# EAGLE schematic BlackIce (EAGLE 6.6.0)
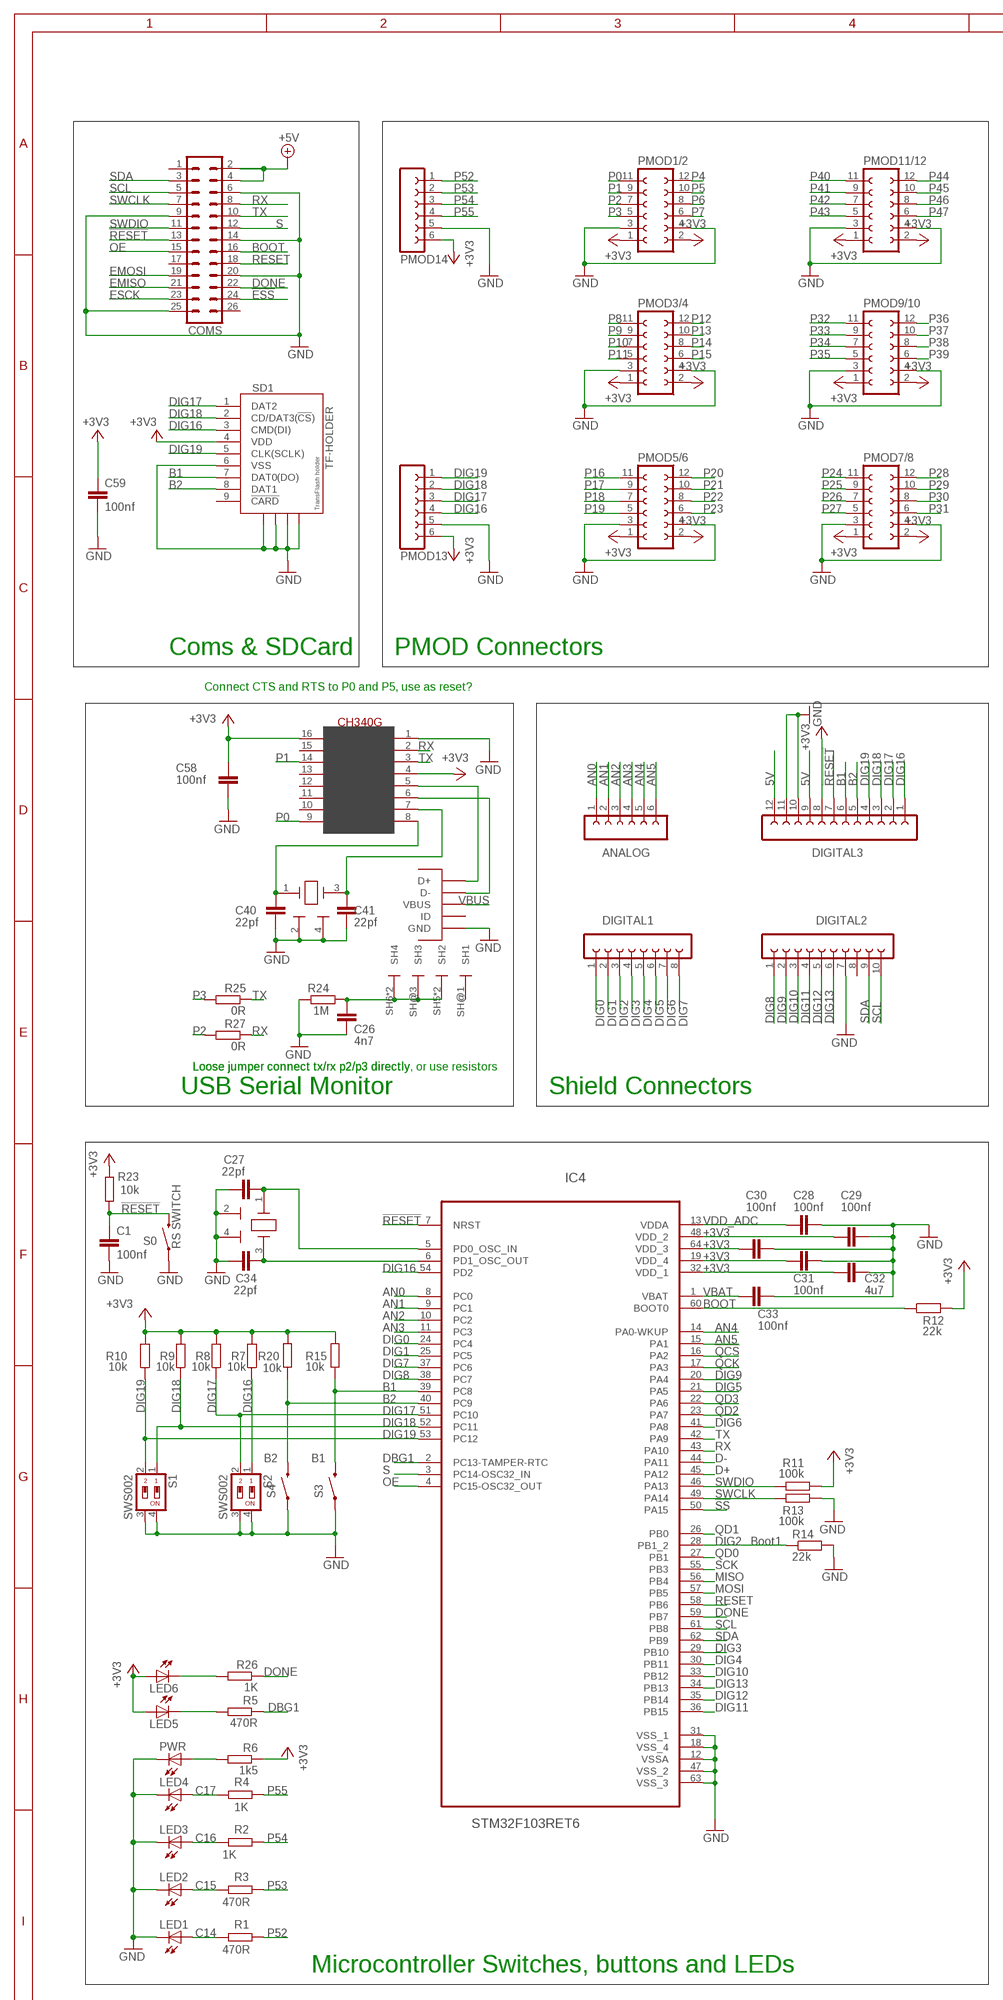
[diagram p0: schematic, sheet 1, part 1 of 2]
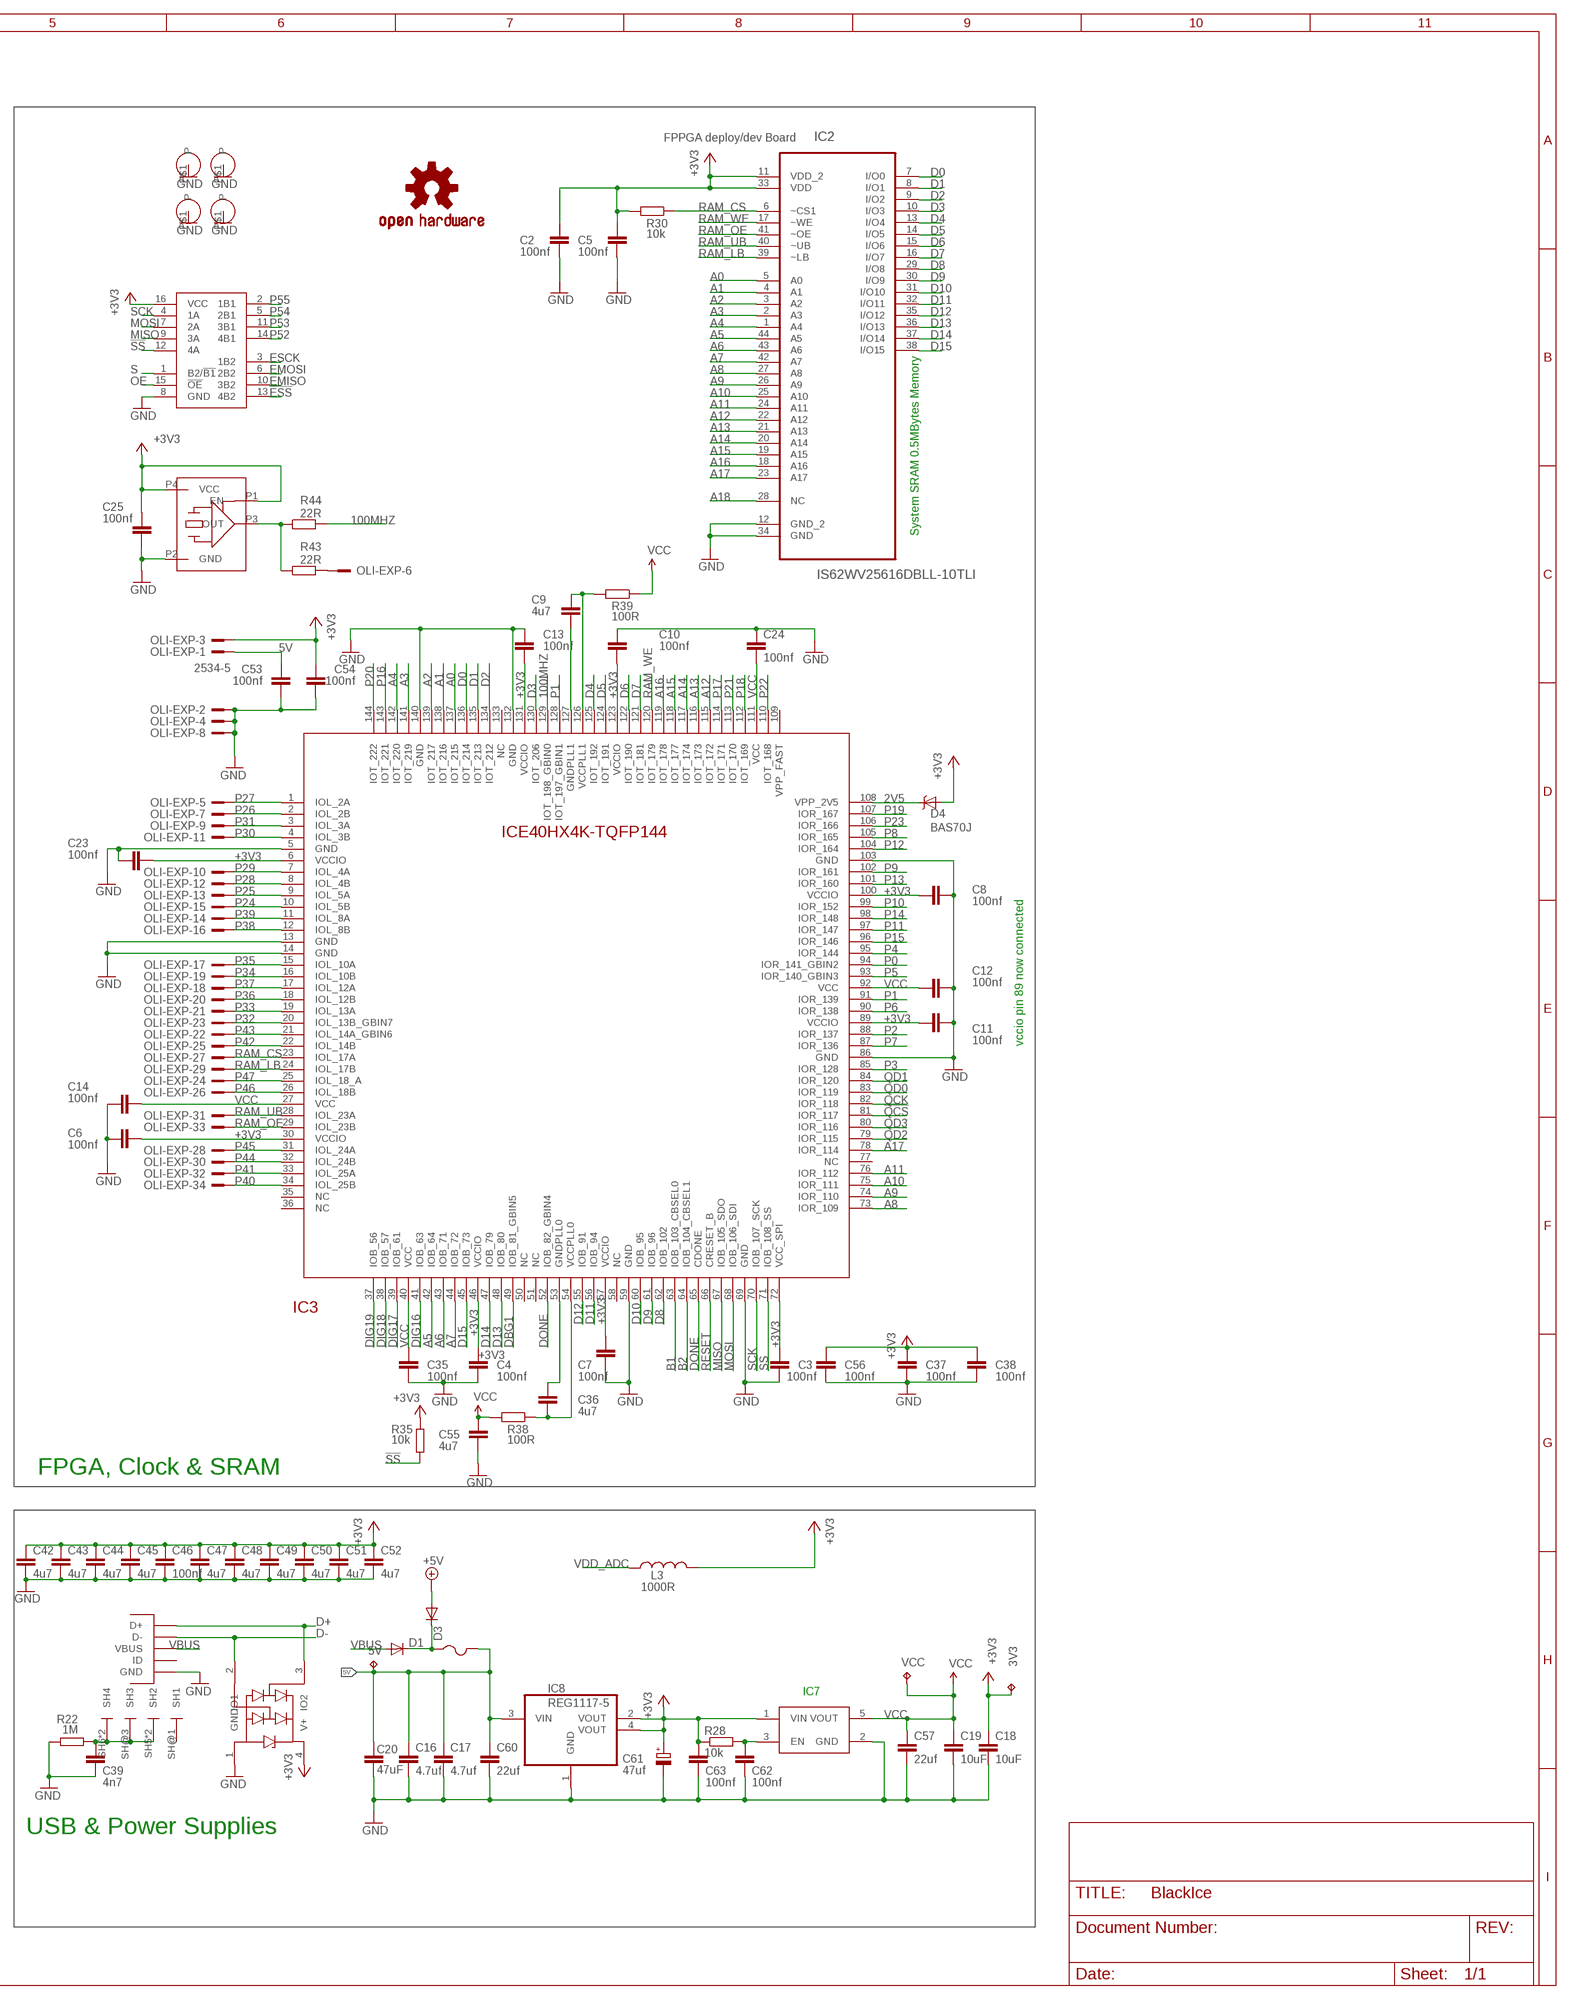
[diagram p1: schematic, sheet 1, part 2 of 2]

## Parts
3V3  TPB1,27  [B1,27]
5V  TPB1,27  [B1,27]
ANALOG  FE06-1  [FE06]
C1  100nf  C-EUC0402  [C0402]
C2  100nf  C-EUC0402  [C0402]
C3  100nf  C-EUC0402  [C0402]
C4  100nf  C-EUC0402  [C0402]
C5  100nf  C-EUC0402  [C0402]
C6  100nf  C-EUC0402  [C0402]
C7  100nf  C-EUC0402  [C0402]
C8  100nf  C-EUC0402  [C0402]
C9  4u7  C-EUC0402  [C0402]
C10  100nf  C-EUC0402  [C0402]
C11  100nf  C-EUC0402  [C0402]
C12  100nf  C-EUC0402  [C0402]
C13  100nf  C-EUC0402  [C0402]
C14  100nf  C-EUC0402  [C0402]
C16  4.7uf  C-EUC0402  [C0402]
C17  4.7uf  C-EUC0402  [C0402]
C18  10uF  C-EUC0603  [C0603]
C19  10uF  C-EUC0603  [C0603]
C20  47uF  C_1206  [1206]
C23  100nf  C-EUC0402  [C0402]
C24  100nf  C-EUC0402  [C0402]
C25  100nf  C-EUC0402  [C0402]
C26  4n7  C-EUC0402  [C0402]
C27  22pf  C-EUC0402  [C0402]
C28  100nf  C-EUC0402  [C0402]
C29  100nf  C-EUC0402  [C0402]
C30  100nf  C-EUC0402  [C0402]
C31  100nf  C-EUC0402  [C0402]
C32  4u7  C-EUC0402  [C0402]
C33  100nf  C-EUC0402  [C0402]
C34  22pf  C-EUC0402  [C0402]
C35  100nf  C-EUC0402  [C0402]
C36  4u7  C-EUC0402  [C0402]
C37  100nf  C-EUC0402  [C0402]
C38  100nf  C-EUC0402  [C0402]
C39  4n7  C-EUC0402  [C0402]
C40  22pf  C-EUC0402  [C0402]
C41  22pf  C-EUC0402  [C0402]
C42  4u7  C-EUC0402  [C0402]
C43  4u7  C-EUC0402  [C0402]
C44  4u7  C-EUC0402  [C0402]
C45  4u7  C-EUC0402  [C0402]
C46  100nf  C-EUC0402  [C0402]
C47  4u7  C-EUC0402  [C0402]
C48  4u7  C-EUC0402  [C0402]
C49  4u7  C-EUC0402  [C0402]
C50  4u7  C-EUC0402  [C0402]
C51  4u7  C-EUC0402  [C0402]
C52  4u7  C-EUC0402  [C0402]
C53  100nf  C-EUC0402  [C0402]
C54  100nf  C-EUC0402  [C0402]
C55  4u7  C-EUC0402  [C0402]
C56  100nf  C-EUC0402  [C0402]
C57  22uf  C-EUC0603  [C0603]
C58  100nf  C-EUC0402  [C0402]
C59  100nf  C-EUC0402  [C0402]
C60  22uf  C-EUC0603  [C0603]
C61  47uf  CPOL-EUR/2012-12W  [R/2012-12W]
C62  100nf  C-EUC0402  [C0402]
C63  100nf  C-EUC0402  [C0402]
COM  FCI-MICROUSB-B-PEG  [MICROUSB-B-PEG]
COMS  MA13-2  [MA13-2]
D1  DIODE-SOD123  [SOD123]
D3  DIODE-SOD123  [SOD123]
D4  BAS70J  [SOD-323]
DIGITAL1  FE08-1  [FE08]
DIGITAL2  FE10-1  [FE10]
DIGITAL3  FE12-1  [FE12]
ESD1  PRTR5V0U2X  [SOT143B]
F1  PTCFUSE-1206  [R1206]
IC1  CH340G  [SOIC16]
IC2  IS62WV25616DBLL-10TLI  IS62WV25616DBLL-45TLI  [SOP80P1176X120-44N]
IC3  ICE40HX4K_TQFP144  [TQFP144]
IC4  STM32F103RET6  [QFP50P1200X1200X160-64N]
IC6  74CBTLV3257  [TSSOP-16]
IC7  NCP114  [TSOP-5/SOT23-5]
IC8  REG1117-5  [SOT223]
L3  1000R  INDUCTOR0402  [C0402]
LED1  LEDCHIPLED_0603  [CHIPLED_0603]
LED2  LEDCHIPLED_0603  [CHIPLED_0603]
LED3  LEDCHIPLED_0603  [CHIPLED_0603]
LED4  LEDCHIPLED_0603  [CHIPLED_0603]
LED5  LEDCHIPLED_0603  [CHIPLED_0603]
LED6  LEDCHIPLED_0603  [CHIPLED_0603]
OLI-EXP  2534-5  [PAK100/2500-5-34]
OSHW  OSHW-LOGOL  [OSHW-LOGO-L]
PMOD1/2  FE06-2W  [FE06-2W]
PMOD3/4  FE06-2W  [FE06-2W]
PMOD5/6  FE06-2W  [FE06-2W]
PMOD7/8  FE06-2W  [FE06-2W]
PMOD9/10  FE06-2W  [FE06-2W]
PMOD11/12  FE06-2W  [FE06-2W]
PMOD13  FE06W  [FE06W]
PMOD14  FE06W  [FE06W]
PWR  LEDCHIPLED_0603  [CHIPLED_0603]
R1  470R  R-EU_R0402  [R0402]
R2  1K  R-EU_R0402  [R0402]
R3  470R  R-EU_R0402  [R0402]
R4  1K  R-EU_R0402  [R0402]
R5  470R  R-EU_R0402  [R0402]
R6  1k5  R-EU_R0402  [R0402]
R7  10k  R-EU_R0402  [R0402]
R8  10k  R-EU_R0402  [R0402]
R9  10k  R-EU_R0402  [R0402]
R10  10k  R-EU_R0402  [R0402]
R11  100k  R-EU_R0402  [R0402]
R12  22k  R-EU_R0402  [R0402]
R13  100k  R-EU_R0402  [R0402]
R14  22k  R-EU_R0402  [R0402]
R15  10k  R-EU_R0402  [R0402]
R20  10k  R-EU_R0402  [R0402]
R22  1M  R-EU_R0402  [R0402]
R23  10k  R-EU_R0402  [R0402]
R24  1M  R-EU_R0402  [R0402]
R25  0R  R-EU_R0402  [R0402]
R26  1K  R-EU_R0402  [R0402]
R27  0R  R-EU_R0402  [R0402]
R28  10k  R-EU_R0402  [R0402]
R30  10k  R-EU_R0402  [R0402]
R35  10k  R-EU_R0402  [R0402]
R38  100R  R-EU_R0402  [R0402]
R39  100R  R-EU_R0402  [R0402]
R43  22R  R-EU_R0402  [R0402]
R44  22R  R-EU_R0402  [R0402]
S0  RS SWITCH  SWITCH-MOMENTARY-2SMD-1101NE  [TACTILE-SWITCH-1101NE]
S1  SWS002  [SMS-002]
S2  SWS002  [SMS-002]
S3  SWITCH-MOMENTARY-2SMD-1101NE  [TACTILE-SWITCH-1101NE]
S4  SWITCH-MOMENTARY-2SMD-1101NE  [TACTILE-SWITCH-1101NE]
SD1  TF-HOLDER  [TF-PULL]
U$2  FCI-MICROUSB-B-PEG  [MICROUSB-B-PEG]
U$16  HOLE-2.5MM  [2.5MM-HOLE]
U$21  HOLE-2.5MM  [2.5MM-HOLE]
U$22  HOLE-2.5MM  [2.5MM-HOLE]
U$24  HOLE-2.5MM  [2.5MM-HOLE]
VCC  TPB1,27  [B1,27]
X1  TXC-7W-20.000MBB-T  [XTAL-7X5]
Y1  12MZ  7M-25  [CRYSTAL-3.2X2.5]
Y2  12Mz  7M-25  [CRYSTAL-3.2X2.5]

## Nets
2V5: D4.C IC3.108(VPP_2V5)
5V: 5V.TP C16.1 C17.1 C20.1 C53.1 C60.1 DIGITAL3.9 DIGITAL3.12 F1.2 IC8.3(VIN) OLI-EXP.1
100MHZ: IC3.129(IOT_198_GBIN0) R44.2
!ESS: COMS.24 IC6.13(4B2)
!QCS: IC3.81(IOR_117) IC4.16(PA2)
!RESET: C1.1 COMS.13 DIGITAL3.7 IC4.7(NRST) R23.1 S0.2
!SS: IC3.71(IOB_108_SS) IC4.50(PA15) IC6.12(4A) R35.2
+3V3: 3V3.TP C2.1 C3.1 C4.1 C5.1 C6.2 C7.1 C8.1 C10.2 C11.1 C13.1 C18.1 C23.1 C25.2 C29.2 C30.2 C31.2 C32.2 C37.1 C38.1 C42.1 C43.1 C44.1 C45.1 C46.1 C47.1 C48.1 C49.1 C50.1 C51.1 C52.1 C54.1 C56.1 C58.2 C59.1 C61.+ C63.2 D4.A DIGITAL3.8 ESD1.4(V+) IC1.4(V3) IC1.16(VCC) IC2.11(VDD_2) IC2.33(VDD) IC3.6(VCCIO) IC3.30(VCCIO) IC3.46(VCCIO) IC3.57(VCCIO) IC3.72(VCC_SPI) IC3.89(VCCIO) IC3.100(VCCIO) IC3.123(VCCIO) IC3.131(VCCIO) IC4.19(VDD_4) IC4.32(VDD_1) IC4.48(VDD_2) IC4.64(VDD_3) IC6.16(VCC) IC7.1(VIN) IC8.2(VOUT) IC8.4(VOUT) L3.1 LED5.A LED6.A OLI-EXP.3 PMOD1/2.1 PMOD1/2.2 PMOD3/4.1 PMOD3/4.2 PMOD5/6.1 PMOD5/6.2 PMOD7/8.1 PMOD7/8.2 PMOD9/10.1 PMOD9/10.2 PMOD11/12.1 PMOD11/12.2 PMOD13.6 PMOD14.6 R6.1 R7.2 R8.2 R9.2 R10.2 R11.1 R12.2 R15.2 R20.2 R23.2 R28.1 R30.2 R35.1 SD1.4(VDD) X1.P1(EN) X1.P4(VCC)
+5V: COMS.2 COMS.4 D3.A
A0: IC2.5(A0) IC3.137(IOT_215)
A1: IC2.4(A1) IC3.138(IOT_216)
A2: IC2.3(A2) IC3.139(IOT_217)
A3: IC2.2(A3) IC3.141(IOT_219)
A4: IC2.1(A4) IC3.142(IOT_220)
A5: IC2.44(A5) IC3.42(IOB_64)
A6: IC2.43(A6) IC3.43(IOB_71)
A7: IC2.42(A7) IC3.44(IOB_72)
A8: IC2.27(A8) IC3.73(IOR_109)
A9: IC2.26(A9) IC3.74(IOR_110)
A10: IC2.25(A10) IC3.75(IOR_111)
A11: IC2.24(A11) IC3.76(IOR_112)
A12: IC2.22(A12) IC3.115(IOT_172)
A13: IC2.21(A13) IC3.116(IOT_173)
A14: IC2.20(A14) IC3.117(IOT_174)
A15: IC2.19(A15) IC3.118(IOT_177)
A16: IC2.18(A16) IC3.119(IOT_178)
A17: IC2.23(A17) IC3.78(IOR_114)
A18: IC2.28(NC)
AN0: ANALOG.1 IC4.8(PC0)
AN1: ANALOG.2 IC4.9(PC1)
AN2: ANALOG.3 IC4.10(PC2)
AN3: ANALOG.4 IC4.11(PC3)
AN4: ANALOG.5 IC4.14(PA0-WKUP)
AN5: ANALOG.6 IC4.15(PA1)
B1: DIGITAL3.6 IC3.63(IOB_103_CBSEL0) IC4.39(PC8) R15.1 S3.2 SD1.7(DAT0(DO))
B2: DIGITAL3.5 IC3.64(IOB_104_CBSEL1) IC4.40(PC9) R20.1 S4.2 SD1.8(DAT1)
BOOT: COMS.16 IC4.60(BOOT0) R12.1
C14: LED1.A R1.1
C15: LED2.A R3.1
C16: LED3.A R2.1
C17: LED4.A R4.1
D0: IC2.7(I/O0) IC3.136(IOT_214)
D1: IC2.8(I/O1) IC3.135(IOT_213)
D2: IC2.9(I/O2) IC3.134(IOT_212)
D3: IC2.10(I/O3) IC3.130(IOT_206)
D4: IC2.13(I/O4) IC3.125(IOT_192)
D5: IC2.14(I/O5) IC3.124(IOT_191)
D6: IC2.15(I/O6) IC3.122(IOT_190)
D7: IC2.16(I/O7) IC3.121(IOT_181)
D8: IC2.29(I/O8) IC3.62(IOB_102)
D9: IC2.30(I/O9) IC3.61(IOB_96)
D10: IC2.31(I/O10) IC3.60(IOB_95)
D11: IC2.32(I/O11) IC3.56(IOB_94)
D12: IC2.35(I/O12) IC3.55(IOB_91)
D13: IC2.36(I/O13) IC3.48(IOB_80)
D14: IC2.37(I/O14) IC3.47(IOB_79)
D15: IC2.38(I/O15) IC3.45(IOB_73)
D+: ESD1.3(IO2) IC4.45(PA12) U$2.P$3(D+)
D-: ESD1.2(IO1) IC4.44(PA11) U$2.P$2(D-)
DBG1: IC3.49(IOB_81_GBIN5) IC4.2(PC13-TAMPER-RTC) R5.1
DIG0: DIGITAL1.1 IC4.24(PC4)
DIG1: DIGITAL1.2 IC4.25(PC5)
DIG2: DIGITAL1.3 IC4.28(PB1_2) R14.1
DIG3: DIGITAL1.4 IC4.29(PB10)
DIG4: DIGITAL1.5 IC4.30(PB11)
DIG5: DIGITAL1.6 IC4.21(PA5)
DIG6: DIGITAL1.7 IC4.41(PA8)
DIG7: DIGITAL1.8 IC4.37(PC6)
DIG8: DIGITAL2.1 IC4.38(PC7)
DIG9: DIGITAL2.2 IC4.20(PA4)
DIG10: DIGITAL2.3 IC4.33(PB12)
DIG11: DIGITAL2.4 IC4.36(PB15)
DIG12: DIGITAL2.5 IC4.35(PB14)
DIG13: DIGITAL2.6 IC4.34(PB13)
DIG16: DIGITAL3.1 IC3.41(IOB_63) IC4.54(PD2) PMOD13.4 R7.1 S2.1 SD1.3(CMD(DI))
DIG17: DIGITAL3.2 IC3.39(IOB_61) IC4.51(PC10) PMOD13.3 R8.1 S2.2 SD1.1(DAT2)
DIG18: DIGITAL3.3 IC3.38(IOB_57) IC4.52(PC11) PMOD13.2 R9.1 S1.1 SD1.2(CD/DAT3(!CS!))
DIG19: DIGITAL3.4 IC3.37(IOB_56) IC4.53(PC12) PMOD13.1 R10.1 S1.2 SD1.5(CLK(SCLK))
DONE: COMS.22 IC3.52(IOB_82_GBIN4) IC3.65(CDONE) IC4.59(PB7) R26.1
EMISO: COMS.21 IC6.10(3B2)
EMOSI: COMS.19 IC6.6(2B2)
ESCK: COMS.23 IC6.3(1B2)
GND: C1.2 C2.2 C3.2 C4.2 C5.2 C6.1 C7.2 C8.2 C10.1 C11.2 C12.2 C13.2 C14.2 C16.2 C17.2 C18.2 C19.2 C20.2 C23.2 C24.1 C25.1 C26.1 C27.1 C28.1 C29.1 C30.1 C31.1 C32.1 C33.1 C34.1 C35.2 C37.2 C38.2 C39.1 C40.1 C41.1 C42.2 C43.2 C44.2 C45.2 C46.2 C47.2 C48.2 C49.2 C50.2 C51.2 C52.2 C53.2 C54.2 C55.2 C56.2 C57.2 C58.1 C59.2 C60.2 C61.- C62.1 C63.1 COM.P$5(GND) COMS.6 COMS.9 COMS.14 COMS.20 COMS.25 DIGITAL2.7 DIGITAL3.10 DIGITAL3.11 ESD1.1(GND) IC1.1(GND) IC2.12(GND_2) IC2.34(GND) IC3.5(GND) IC3.13(GND) IC3.14(GND) IC3.59(GND) IC3.69(GND) IC3.86(GND) IC3.103(GND) IC3.132(GND) IC3.140(GND) IC4.12(VSSA) IC4.18(VSS_4) IC4.31(VSS_1) IC4.47(VSS_2) IC4.63(VSS_3) IC6.8(GND) IC7.2(GND) IC8.1(GND) LED1.C LED2.C LED3.C LED4.C OLI-EXP.2 OLI-EXP.4 OLI-EXP.8 PMOD1/2.3 PMOD1/2.4 PMOD3/4.3 PMOD3/4.4 PMOD5/6.3 PMOD5/6.4 PMOD7/8.3 PMOD7/8.4 PMOD9/10.3 PMOD9/10.4 PMOD11/12.3 PMOD11/12.4 PMOD13.5 PMOD14.5 PWR.C R13.1 R14.2 R22.2 R24.2 S0.1 S1.3 S1.4 S2.3 S2.4 S3.1 S4.1 SD1.6(VSS) SD1.S1 SD1.S2 SD1.S3 SD1.S4 U$2.P$5(GND) U$16.P$1(P) U$21.P$1(P) U$22.P$1(P) U$24.P$1(P) X1.P2(GND) Y1.2(GND) Y1.4(GND) Y2.2(GND) Y2.4(GND)
MISO: IC3.67(IOB_105_SDO) IC4.56(PB4) IC6.9(3A)
MOSI: IC3.68(IOB_106_SDI) IC4.57(PB5) IC6.7(2A)
N$1: PWR.A R6.2
N$2: LED5.C R5.2
N$3: C9.2 IC3.126(VCCPLL1) R39.2
N$4: C39.2 R22.1 U$2.SH5(SH2) U$2.SH6(SH4) U$2.SH@2(SH2) U$2.SH@3(SH3) U$2.SH@4(SH4)
N$5: C62.2 IC7.3(EN) R28.2
N$6: C36.1 IC3.53(GNDPLL0)
N$7: C34.2 IC4.6(PD1_OSC_OUT) Y1.3(X2)
N$8: R43.1 R44.1 X1.P3(OUT)
N$9: D1.C D3.C F1.1
N$10: COM.P$3(D+) IC1.5(D+)
N$11: COM.P$2(D-) IC1.6(D-)
N$12: C26.2 COM.SH5(SH2) COM.SH6(SH4) COM.SH@2(SH2) COM.SH@3(SH3) COM.SH@4(SH4) R24.1
N$14: C9.1 IC3.127(GNDPLL1)
N$15: OLI-EXP.6 R43.2
N$18: C36.2 IC3.54(VCCPLL0) R38.1
N$19: C27.2 IC4.5(PD0_OSC_IN) Y1.1(X1)
N$20: C41.2 IC1.7(XI) Y2.3(X2)
N$21: C40.2 IC1.8(XO) Y2.1(X1)
N$22: LED6.C R26.2
OE: COMS.15 IC4.4(PC15-OSC32_OUT) IC6.15(!OE)
P0: IC1.9(CTS) IC3.94(IOR_141_GBIN2) PMOD1/2.11
P1: IC1.14(RTS) IC3.91(IOR_139) IC3.128(IOT_197_GBIN1) PMOD1/2.9
P2: IC3.88(IOR_137) PMOD1/2.7 R27.2
P3: IC3.85(IOR_128) PMOD1/2.5 R25.2
P4: IC3.95(IOR_144) PMOD1/2.12
P5: IC3.93(IOR_140_GBIN3) PMOD1/2.10
P6: IC3.90(IOR_138) PMOD1/2.8
P7: IC3.87(IOR_136) PMOD1/2.6
P8: IC3.105(IOR_165) PMOD3/4.11
P9: IC3.102(IOR_161) PMOD3/4.9
P10: IC3.99(IOR_152) PMOD3/4.7
P11: IC3.97(IOR_147) PMOD3/4.5
P12: IC3.104(IOR_164) PMOD3/4.12
P13: IC3.101(IOR_160) PMOD3/4.10
P14: IC3.98(IOR_148) PMOD3/4.8
P15: IC3.96(IOR_146) PMOD3/4.6
P16: IC3.143(IOT_221) PMOD5/6.11
P17: IC3.114(IOT_171) PMOD5/6.9
P18: IC3.112(IOT_169) PMOD5/6.7
P19: IC3.107(IOR_167) PMOD5/6.5
P20: IC3.144(IOT_222) PMOD5/6.12
P21: IC3.113(IOT_170) PMOD5/6.10
P22: IC3.110(IOT_168) PMOD5/6.8
P23: IC3.106(IOR_166) PMOD5/6.6
P24: IC3.10(IOL_5B) OLI-EXP.15 PMOD7/8.11
P25: IC3.9(IOL_5A) OLI-EXP.13 PMOD7/8.9
P26: IC3.2(IOL_2B) OLI-EXP.7 PMOD7/8.7
P27: IC3.1(IOL_2A) OLI-EXP.5 PMOD7/8.5
P28: IC3.8(IOL_4B) OLI-EXP.12 PMOD7/8.12
P29: IC3.7(IOL_4A) OLI-EXP.10 PMOD7/8.10
P30: IC3.4(IOL_3B) OLI-EXP.11 PMOD7/8.8
P31: IC3.3(IOL_3A) OLI-EXP.9 PMOD7/8.6
P32: IC3.20(IOL_13B_GBIN7) OLI-EXP.23 PMOD9/10.11
P33: IC3.19(IOL_13A) OLI-EXP.21 PMOD9/10.9
P34: IC3.16(IOL_10B) OLI-EXP.19 PMOD9/10.7
P35: IC3.15(IOL_10A) OLI-EXP.17 PMOD9/10.5
P36: IC3.18(IOL_12B) OLI-EXP.20 PMOD9/10.12
P37: IC3.17(IOL_12A) OLI-EXP.18 PMOD9/10.10
P38: IC3.12(IOL_8B) OLI-EXP.16 PMOD9/10.8
P39: IC3.11(IOL_8A) OLI-EXP.14 PMOD9/10.6
P40: IC3.34(IOL_25B) OLI-EXP.34 PMOD11/12.11
P41: IC3.33(IOL_25A) OLI-EXP.32 PMOD11/12.9
P42: IC3.22(IOL_14B) OLI-EXP.25 PMOD11/12.7
P43: IC3.21(IOL_14A_GBIN6) OLI-EXP.22 PMOD11/12.5
P44: IC3.32(IOL_24B) OLI-EXP.30 PMOD11/12.12
P45: IC3.31(IOL_24A) OLI-EXP.28 PMOD11/12.10
P46: IC3.26(IOL_18B) OLI-EXP.26 PMOD11/12.8
P47: IC3.25(IOL_18_A) OLI-EXP.24 PMOD11/12.6
P52: IC6.14(4B1) PMOD14.1 R1.2
P53: IC6.11(3B1) PMOD14.2 R3.2
P54: IC6.5(2B1) PMOD14.3 R2.2
P55: IC6.2(1B1) PMOD14.4 R4.2
QCK: IC3.82(IOR_118) IC4.17(PA3)
QD0: IC3.83(IOR_119) IC4.27(PB1)
QD1: IC3.84(IOR_120) IC4.26(PB0)
QD2: IC3.79(IOR_115) IC4.23(PA7)
QD3: IC3.80(IOR_116) IC4.22(PA6)
RAM_CS: IC2.6(~CS1) IC3.23(IOL_17A) OLI-EXP.27 R30.1
RAM_LB: IC2.39(~LB) IC3.24(IOL_17B) OLI-EXP.29
RAM_OE: IC2.41(~OE) IC3.29(IOL_23B) OLI-EXP.33
RAM_UB: IC2.40(~UB) IC3.28(IOL_23A) OLI-EXP.31
RAM_WE: IC2.17(~WE) IC3.120(IOT_179)
RESET: COMS.18 IC3.66(CRESET_B) IC4.58(PB6)
RX: COMS.8 IC1.2(TX) IC4.43(PA10) R27.1
S: COMS.12 IC4.3(PC14-OSC32_IN) IC6.1(B2/!B1)
SCK: IC3.70(IOB_107_SCK) IC4.55(PB3) IC6.4(1A)
SCL: COMS.5 DIGITAL2.10 IC4.61(PB8)
SDA: COMS.3 DIGITAL2.9 IC4.62(PB9)
SWCLK: COMS.7 IC4.49(PA14) R13.2
SWDIO: COMS.11 IC4.46(PA13) R11.2
TX: COMS.10 IC1.3(RX) IC4.42(PA9) R25.1
VBAT: C33.2 IC4.1(VBAT)
VBUS: COM.P$1(VBUS) D1.A U$2.P$1(VBUS)
VCC: C12.1 C14.1 C19.1 C24.2 C35.1 C55.1 C57.1 IC3.27(VCC) IC3.40(VCC) IC3.92(VCC) IC3.111(VCC) IC7.5(VOUT) R38.2 R39.1 VCC.TP
VDD_ADC: C28.2 IC4.13(VDDA) L3.2
Unconnected: COM.P$4(ID) COM.SH@1(SH1) COMS.1 COMS.17 COMS.26 DIGITAL2.8 IC1.10(DSR) IC1.11(RI) IC1.12(DCD) IC1.13(DTR) IC1.15(RS232) IC3.35(NC) IC3.36(NC) IC3.50(NC) IC3.51(NC) IC3.58(NC) IC3.77(NC) IC3.109(VPP_FAST) IC3.133(NC) IC7.4(NC) SD1.9(!CARD) U$2.P$4(ID) U$2.SH@1(SH1)

## Notes on the sheet
- FPPGA deploy/dev Board
- System SRAM 0.5MBytes Memory
- Coms & SDCard | PMOD Connectors
- Connect CTS and RTS to P0 and P5, use as reset?
- Loose jumper connect tx/rx p2/p3 directly | Loose jumper connect tx/rx p2/p3 directly, or use resistors | vccio pin 89 now connected
- USB Serial Monitor | Shield Connectors
- FPGA, Clock & SRAM
- Boot1
- IC7
- USB & Power Supplies
- Microcontroller Switches, buttons and LEDs

## Library data of the parts
3V3 5V VCC = testpad:TP: Test pad
ANALOG = con-lsta:FE06-1: FEMALE HEADER; OC_FARNELL: unknown; OC_NEWARK: unknown
C1-C14 C16-C19 C23-C60 C62 C63 = rcl:C-EU: CAPACITOR, European symbol
C20 = C:C
C61 = rcl:CPOL-EU: POLARIZED CAPACITOR, European symbol
COM U$2 = amino:FCI-MICROUSB-B-PEG
COMS = con-lstb:MA13-2: PIN HEADER; OC_FARNELL: unknown; OC_NEWARK: unknown
D1 D3 = diode:DIODE-: DIODE
D4 = ELL-i-DiscreteSemi:BAS70: Silicon Schottky Diodes General-purpose diode for high-speed switching. Maximum forward current 70 mA Maxiumum forward voltage drop Vf 0.410 mV Maximum reverse voltage 70V
DIGITAL1 = con-lsta:FE08-1: FEMALE HEADER; OC_FARNELL: unknown; OC_NEWARK: unknown
DIGITAL2 = con-lsta:FE10-1: FEMALE HEADER; OC_FARNELL: unknown; OC_NEWARK: unknown
DIGITAL3 = con-lsta:FE12-1: FEMALE HEADER; OC_FARNELL: unknown; OC_NEWARK: unknown
ESD1 = amino:PRTR5V0U2X
F1 = PTCFUSE:PTCFUSE
IC1 = usb-serial:CH340G
IC2 = memory-sram:IS62WV25616DBLL-45TLI: STATIC SRAM; MPN: IS62WV25616DBLL-45TLI; OC_FARNELL: 1869970; OC_NEWARK: 32T7410; PACKAGE: TSSOP-44; SUPPLIER: INTEGRATED SILICON SOLUTION (ISSI)
IC3 = ICE40:ICE40HX4K_TQFP144
IC4 = stm:STM32F103RET6: ARM-based 32-bit MCU; MPN: STM32F103RET6; OC_FARNELL: 1624138; OC_NEWARK: 01P4101; PACKAGE: QFP-64; SUPPLIER: STMICROELECTRONICS
IC6 = amino:74CBTLV3257
IC7 = amino:NCP114
IC8 = amino:REG1117-5
L3 = SparkFun-Passives:INDUCTOR: Inductors Basic Inductor/Choke - 0603 and 1206. Footprints are not proven and vary greatly between part numbers. SRN6045- 33uH, 20% 1.4A SDR0403-560KL - 56uH, 10%, 500mA RMS/740mA peak
LED1-LED6 PWR = led:LED: LED OSRAM: - CHIPLED LG R971, LG N971, LY N971, LG Q971, LY Q971, LO R971, LY R971 LH N974, LH R974 LS Q976, LO Q976, LY Q976 LO Q996 - Hyper CHIPLED LW Q18S LB Q993, LB Q99A, LB R99A - SideLED LS A670, LO A670, LY A670, LG A670, LP A670 LB A673, LV A673, LT A673, LW A673 LH A674 LY A675 LS A676, LA A676, LO A676, LY A676, LW A676 LS A679, LY A679, LG A679 - Hyper Micro SIDELED® LS Y876, LA Y876, LO Y876, LY Y876 LT Y87S - SmartLED LW L88C, LW L88S LB L89C, LB L89S, LG L890 LS L89K, LO L89K, LY L89K LS L896, LA L896, LO L896, LY L896 - TOPLED LS T670, LO T670, LY T670, LG T670, LP T670 LSG T670, LSP T670, LSY T670, LOP T670, LYG T670 LG T671, LOG T671, LSG T671 LB T673, LV T673, LT T673, LW T673 LH T674 LS T676, LA T676, LO T676, LY T676, LB T676, LH T676, LSB T676, LW T676 LB T67C, LV T67C, LT T67C, LS T67K, LO T67K, LY T67K, LW E67C LS E67B, LA E67B, LO E67B, LY E67B, LB E67C, LV E67C, LT E67C LW T67C LS T679, LY T679, LG T679 LS T770, LO T770, LY T770, LG T770, LP T770 LB T773, LV T773, LT T773, LW T773 LH T774 LS E675, LA E675, LY E675, LS T675 LS T776, LA T776, LO T776, LY T776, LB T776 LHGB T686 LT T68C, LB T68C - Hyper Mini TOPLED® LB M676 - Mini TOPLED Santana® LG M470 LS M47K, LO M47K, LY M47K Source: http://www.osram.convergy.de LUXEON: - LUMILED® LXK2-PW12-R00, LXK2-PW12-S00, LXK2-PW14-U00, LXK2-PW14-V00 LXK2-PM12-R00, LXK2-PM12-S00, LXK2-PM14-U00 LXK2-PE12-Q00, LXK2-PE12-R00, LXK2-PE12-S00, LXK2-PE14-T00, LXK2-PE14-U00 LXK2-PB12-K00, LXK2-PB12-L00, LXK2-PB12-M00, LXK2-PB14-N00, LXK2-PB14-P00, LXK2-PB14-Q00 LXK2-PR12-L00, LXK2-PR12-M00, LXK2-PR14-Q00, LXK2-PR14-R00 LXK2-PD12-Q00, LXK2-PD12-R00, LXK2-PD12-S00 LXK2-PH12-R00, LXK2-PH12-S00 LXK2-PL12-P00, LXK2-PL12-Q00, LXK2-PL12-R00 Source: www.luxeon.com KINGBRIGHT: KA-3528ASYC Source: www.kingbright.com
OLI-EXP = con-3m:2534-: 3M (TM) Pak 100 4-Wall Header Source: 3M; OC_FARNELL: 9838406; OC_NEWARK: unknown
OSHW = SparkFun:OSHW-LOGO: Open Source Hardware Logo This logo indicates the piece of hardware it is found on incorporates a OSHW license and/or adheres to the definition of open source hardware found here: http://freedomdefined.org/OSHW
PMOD1/2 PMOD3/4 PMOD5/6 PMOD7/8 PMOD9/10 PMOD11/12 = con-lsta:FE06-2W: FEMALE HEADER; OC_FARNELL: unknown; OC_NEWARK: unknown
PMOD13 PMOD14 = con-lsta:FE06W: FEMALE HEADER; OC_FARNELL: unknown; OC_NEWARK: unknown
R1-R15 R20 R22 R24-R28 R30 R35 R38 R39 R43 R44 = resistor:R-EU_: RESISTOR, European symbol
R23 = rcl:R-EU_: RESISTOR, European symbol
S0 S3 S4 = SparkFun-Electromechanical:SWITCH-MOMENTARY-2: Various NO switches- pushbuttons, reed, etc; PROD_ID: SWCH-00815
S1 S2 = smd-special:SWS002: SMD Dip Switch 2 pol.
SD1 = sd-mmc:TF-HOLDER: TF / Micro SD socket is PUSH-PUSH type, the card can be pushed into and auto locked and pushed out by simply press the card. Surface Mounting type.
U$16 U$21 U$22 U$24 = amino:HOLE-2.5MM
X1 = amino:TXC-7W-20.000MBB-T
Y1 Y2 = amino:7M-25

## Net classes
2 thin_power: width 0.254 mm